# Altium schematic sheet KI_Bus.SchDoc
size A4
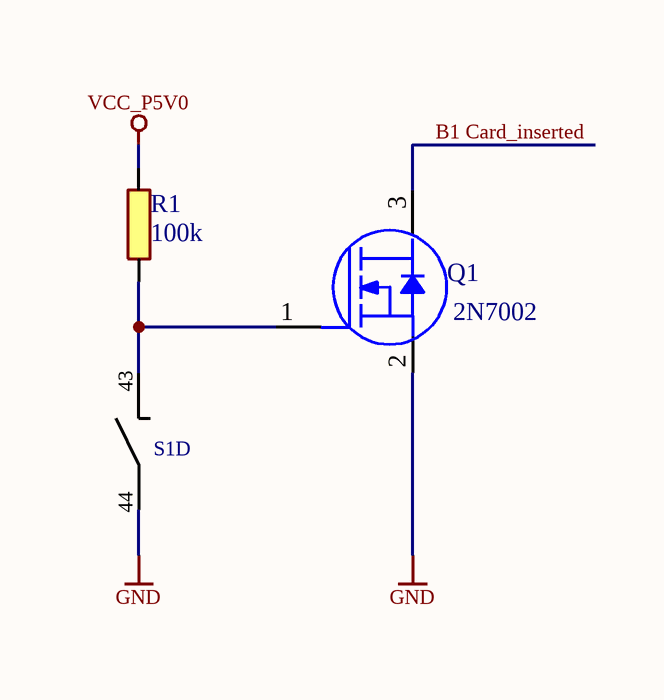
[diagram p0: KI_Bus.SchDoc]

## Parts
Q1  2N7002  [SOT23-3_N]
R1  100k  [RESC0603(1608)_N]
S1  Automasjonsbryter  (value not drawn)  (part D of 10)

## Nets
GND: Q1.2(Source) S1.44
VCC_P5V0: R1.2
B1 Card_inserted: Q1.3(Drain)
NetQ1_1: Q1.1(Gate) R1.1 S1.43

## Notes on the sheet
- Size:
- Date:
- Title:
- A3
- Revision:
- Sheet
- of
- Author:
- File:

## Library data of the parts
Q1 = 2213: N-Channel MOSFET 300mA; id: 2213; rad: 2; rom: OV; lager_type: Fremlager; dybde: 0; hylle: 4; antall: 100; kolonne: 3; pakke_opprettet_av: 815; pakke_opprettet: 08.07.2014 20.37.25; symbol_opprettet_av: 774; symbol_opprettet: 11.07.2014 23.17.04; leverandor_varenr: 1829184; leverandor: Farnell; pakketype: SMD; navn: 2N7002; pris: 2
R1 = 2384: 0.1W 1% Thick film resistor; rad: -1; rom: OV; lager_type: Fremlager; dybde: 96; hylle: 6; antall: 100; kolonne: 0; pakke_opprettet_av: 815; pakke_opprettet: 08.07.2014 21.15.30; symbol_opprettet: 08.07.2014 21.16.33; pakketype: 0603; id: 2384; navn: 100k; symbol_opprettet_av: 815; pris: 0; nokkelord: Resistor
S1 = 3182: Kraftig; id: 3182; symbol_opprettet_av: 815; symbol_opprettet: 05.07.2015 13.10.20; pris: 100; navn: Automasjonsbryter; pakketype: -